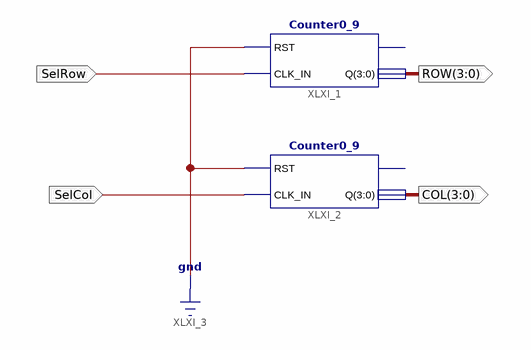
[diagram p0: schematic sheet 1]
// Xilinx ISE schematic Cursor.sch (spartan6) as structural Verilog: 2 symbols, 4 ports
module Cursor (
  input  SelRow,
  input  SelCol,
  output [3:0] ROW,
  output [3:0] COL
);

  Counter0_9 XLXI_1 (.RST(1'b0), .CLK_IN(SelRow), .Q(ROW));  // open: TC
  Counter0_9 XLXI_2 (.RST(1'b0), .CLK_IN(SelCol), .Q(COL));  // open: TC
endmodule
